# Altium schematic sheet yard-ice-fpga-pwr.SchDoc: Yard-Ice-FPGA
size 365 x 274 mm; Revision: 1.0; SheetNumber: 4; SheetTotal: 5
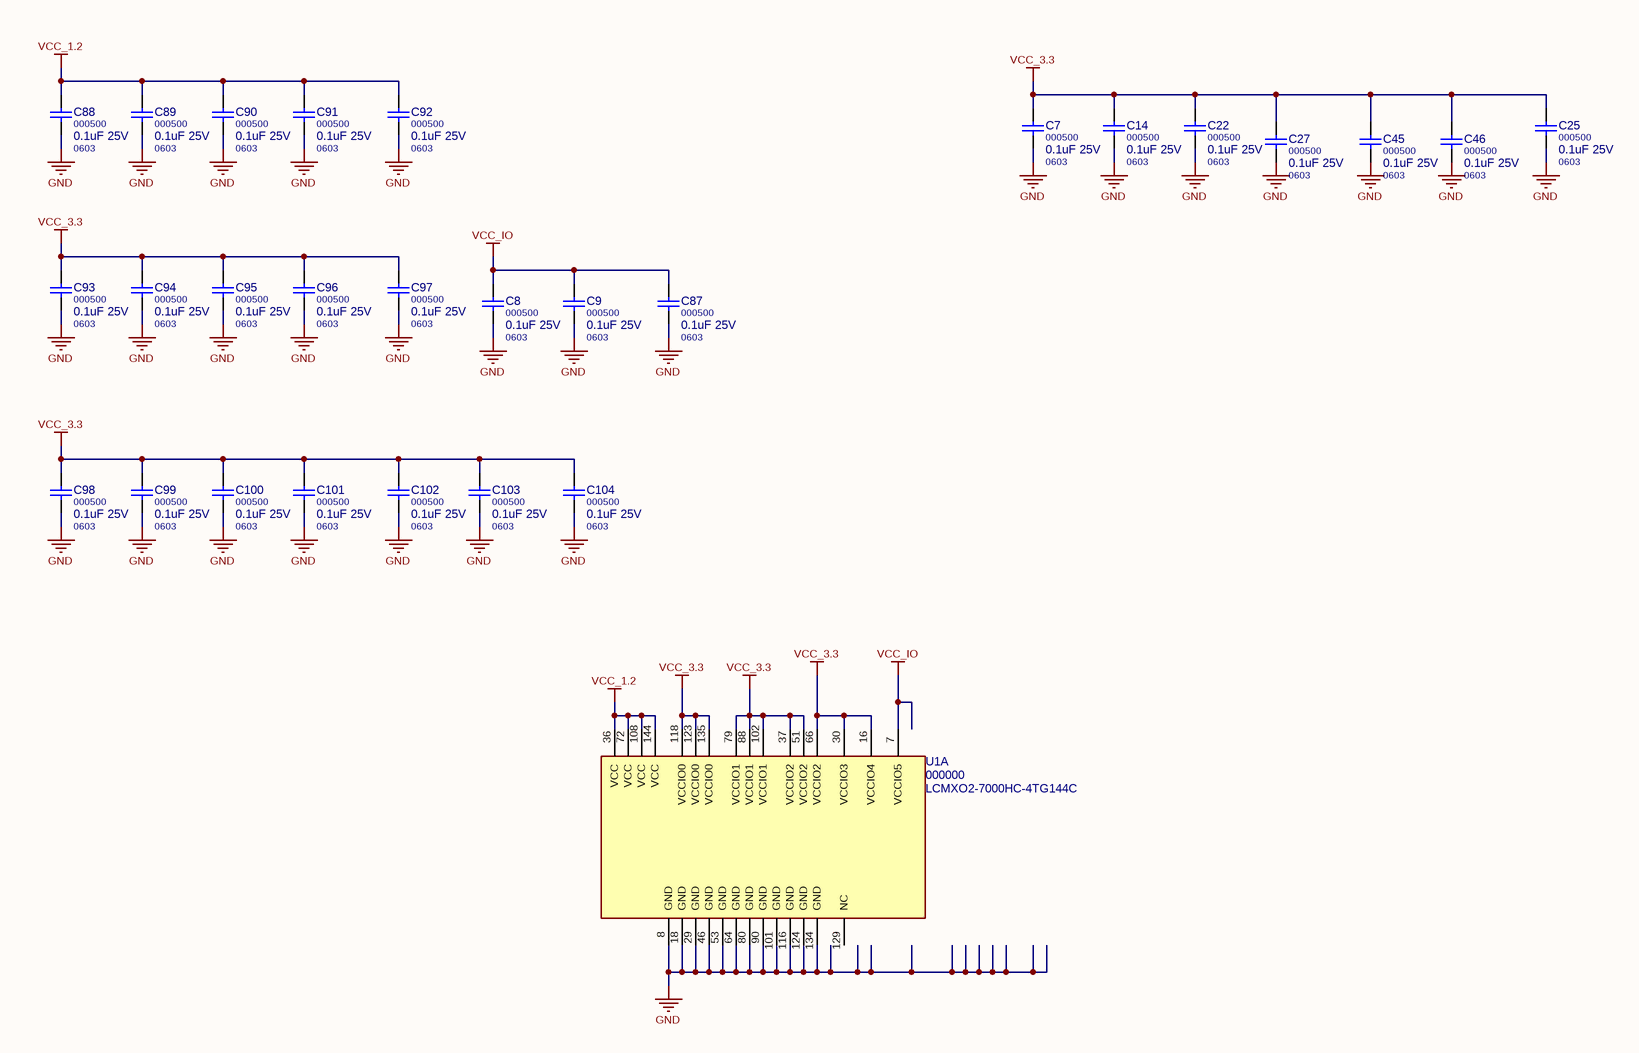
[diagram p0: yard-ice-fpga-pwr.SchDoc]

## Parts
C7  000500  value 0.1uF 25V  Package: 0603  [C0603M]
C8  000500  value 0.1uF 25V  Package: 0603  [C0603M]
C9  000500  value 0.1uF 25V  Package: 0603  [C0603M]
C14  000500  value 0.1uF 25V  Package: 0603  [C0603M]
C22  000500  value 0.1uF 25V  Package: 0603  [C0603M]
C25  000500  value 0.1uF 25V  Package: 0603  [C0603M]
C27  000500  value 0.1uF 25V  Package: 0603  [C0603M]
C45  000500  value 0.1uF 25V  Package: 0603  [C0603M]
C46  000500  value 0.1uF 25V  Package: 0603  [C0603M]
C87  000500  value 0.1uF 25V  Package: 0603  [C0603M]
C88  000500  value 0.1uF 25V  Package: 0603  [C0603M]
C89  000500  value 0.1uF 25V  Package: 0603  [C0603M]
C90  000500  value 0.1uF 25V  Package: 0603  [C0603M]
C91  000500  value 0.1uF 25V  Package: 0603  [C0603M]
C92  000500  value 0.1uF 25V  Package: 0603  [C0603M]
C93  000500  value 0.1uF 25V  Package: 0603  [C0603M]
C94  000500  value 0.1uF 25V  Package: 0603  [C0603M]
C95  000500  value 0.1uF 25V  Package: 0603  [C0603M]
C96  000500  value 0.1uF 25V  Package: 0603  [C0603M]
C97  000500  value 0.1uF 25V  Package: 0603  [C0603M]
C98  000500  value 0.1uF 25V  Package: 0603  [C0603M]
C99  000500  value 0.1uF 25V  Package: 0603  [C0603M]
C100  000500  value 0.1uF 25V  Package: 0603  [C0603M]
C101  000500  value 0.1uF 25V  Package: 0603  [C0603M]
C102  000500  value 0.1uF 25V  Package: 0603  [C0603M]
C103  000500  value 0.1uF 25V  Package: 0603  [C0603M]
C104  000500  value 0.1uF 25V  Package: 0603  [C0603M]
U1  000000  value LCMXO2-7000HC-4TG144C  [144-TQFP]  (part A of 7)

## Nets
GND: C7.2 C8.2 C9.2 C14.2 C22.2 C25.2 C27.2 C45.2 C46.2 C87.2 C88.2 C89.2 C90.2 C91.2 C92.2 C93.2 C94.2 C95.2 C96.2 C97.2 C98.2 C99.2 C100.2 C101.2 C102.2 C103.2 C104.2 U1.8(GND) U1.18(GND) U1.29(GND) U1.46(GND) U1.53(GND) U1.64(GND) U1.80(GND) U1.90(GND) U1.101(GND) U1.116(GND) U1.124(GND) U1.134(GND)
VCC_1.2: C88.1 C89.1 C90.1 C91.1 C92.1 U1.36(VCC) U1.72(VCC) U1.108(VCC) U1.144(VCC)
VCC_3.3: C7.1 C14.1 C22.1 C25.1 C27.1 C45.1 C46.1 C93.1 C94.1 C95.1 C96.1 C97.1 C98.1 C99.1 C100.1 C101.1 C102.1 C103.1 C104.1 U1.16(VCCIO4) U1.30(VCCIO3) U1.37(VCCIO2) U1.51(VCCIO2) U1.66(VCCIO2) U1.79(VCCIO1) U1.88(VCCIO1) U1.102(VCCIO1) U1.118(VCCIO0) U1.123(VCCIO0) U1.135(VCCIO0)
VCC_IO: C8.1 C9.1 C87.1 U1.7(VCCIO5)

Not connected (* = marked no-connect by the designer): U1 129(NC)

## Notes on the sheet
- TITLE
- CHK
- DWN
- APV
- DWG
- REV
- File:
- Sheet
- of

## Library data of the parts
C7-C9 C14 C22 C25 C27 C45 C46 C87-C104 = C0603: SMD Ceramic Chip Capacitor - 0603 - X7R; MF PN: C1608X7R1E104K; MF: TDK; PN: 000500
U1 = LCMXO2-7000HC: FPGA, 1280 Logic Elements, OTP; MF: Lattice; Digy-Key PN: 220-1567-ND; PN: 000000; Package: 144-LQFP; ExtraInfo: *; MF PN: LCMXO2-7000HC-4TG144C